# Altium schematic sheet SD²原理图.SchDoc: ESP8266小电视
size A4; DrawnBy: Misaka; Address1: L3, 12a Rodborough Rd; Address2: Frenchs Forest; Address3: NSW; Address4: Australia 2086; Revision: Rev 1.0; SheetNumber: 1; SheetTotal: 1; PageSetup: Record=PageOptions|CenterHorizontal=True|CenterVertical=True|PrintScale=1.00|XCorrection=1.00|YCorrection=1.00|PrintKind=0|BorderSize=5000000|LeftOffset=0|BottomOffset=0|Orientation=2|PaperLength=1000|PaperWidth=1000|Scale=100|PaperSource=7|PrintQuality=-3|MediaType=1|DitherType=10|PrintScaleMode=1|PaperKind=A4|PaperIndex=9
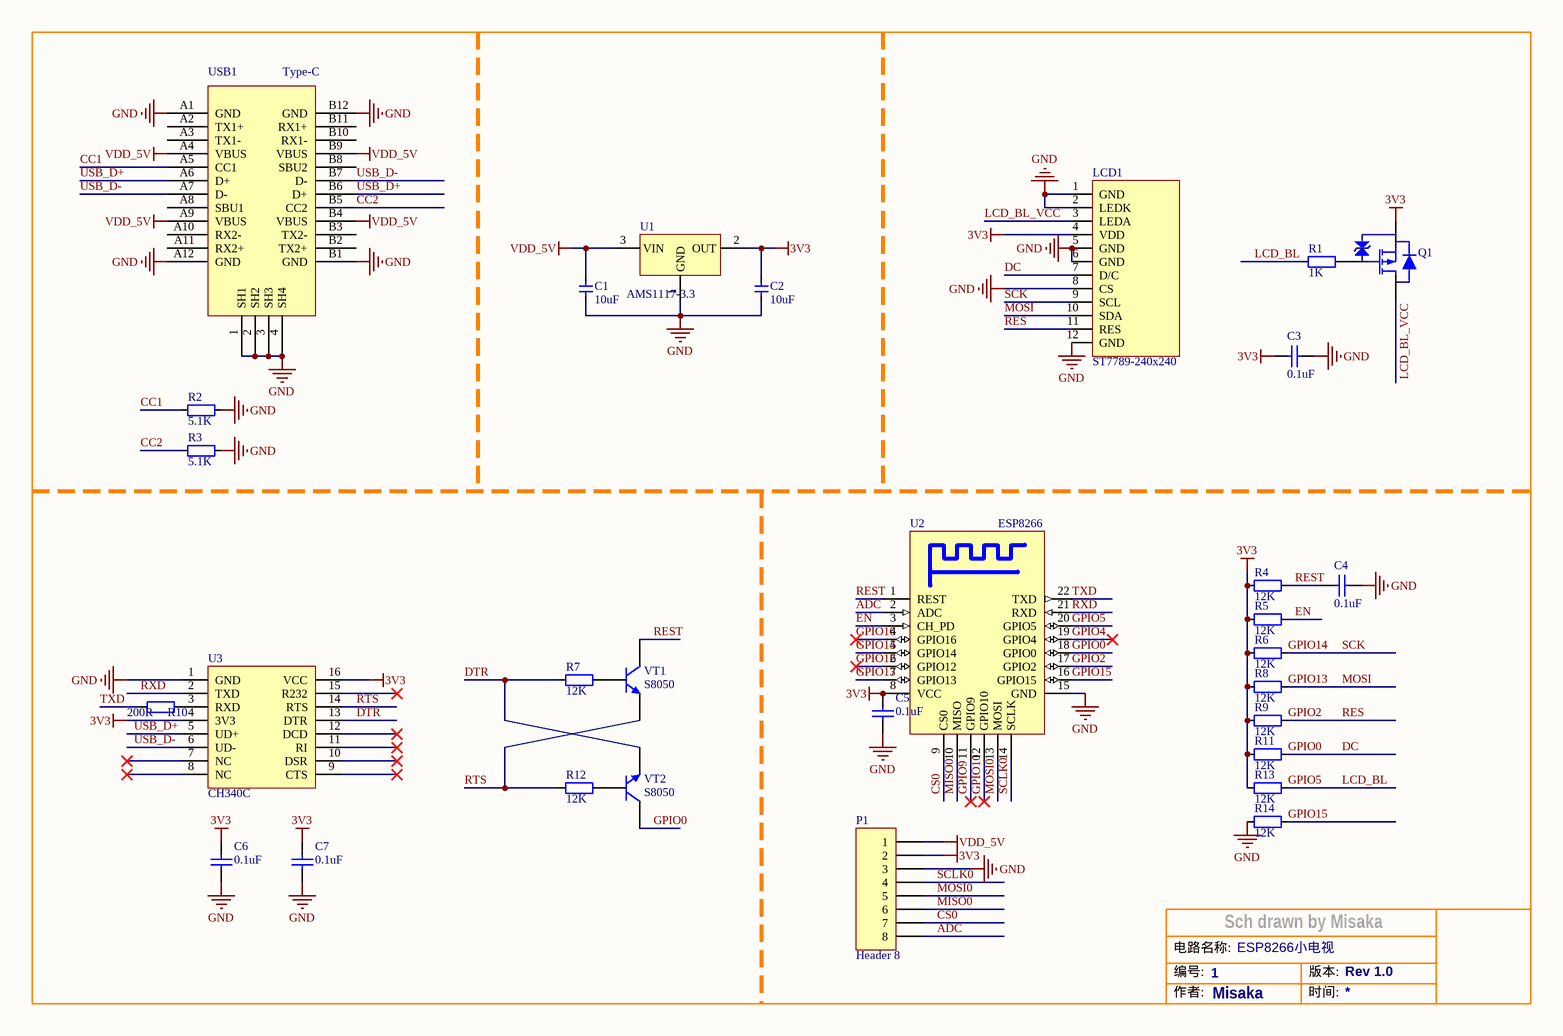
[diagram p0: SD²原理图.SchDoc]

## Parts
C1  10uF  [C_0603]
C2  10uF  [C_0603]
C3  0.1uF  [C_0603]
C4  0.1uF  [C_0603]
C5  0.1uF  [C_0603]
C6  0.1uF  [C_0603]
C7  0.1uF  [C_0603]
LCD1  ST7789-240x240  [LCD-240X240-12P]
P1  Header 8  [FFC_0.5_8]
Q1  AO3415A  [SOT-23-y]  (value not drawn)
R1  1K  [R_0603]
R2  5.1K  [R_0603]
R3  5.1K  [R_0603]
R4  12K  [R_0603]
R5  12K  [R_0603]
R6  12K  [R_0603]
R7  12K  [R_0603]
R8  12K  [R_0603]
R9  12K  [R_0603]
R10  200R  [R_0603]
R11  12K  [R_0603]
R12  12K  [R_0603]
R13  12K  [R_0603]
R14  12K  [R_0603]
U1  AMS1117-3.3  [SOT223_y]
U2  ESP8266  [8266]
U3  CH340C  [SOP16N_N]
USB1  Type-C  [Type-C-TOP]
VT1  S8050  [SOT-23-y]
VT2  S8050  [SOT-23-y]

## Nets
3V3: C2.2 C3.2 C5.2 C6.2 C7.2 LCD1.4(VDD) P1.2 Q1.2(S) R4.1 R5.1 R6.1 R8.1 R9.1 R11.1 R13.1 U1.2(OUT) U2.8(VCC) U3.4(3V3) U3.16(VCC)
GND: C1.1 C2.1 C3.1 C4.1 C5.1 C6.1 C7.1 LCD1.1(GND) LCD1.2(LEDK) LCD1.5(GND) LCD1.6(GND) LCD1.8(CS) LCD1.12(GND) P1.3 R2.2 R3.2 R14.1 U1.1(GND) U2.15(GND) U3.1(GND) USB1.1(SH1) USB1.2(SH2) USB1.3(SH3) USB1.4(SH4) USB1.A1(GND) USB1.A12(GND) USB1.B1(GND) USB1.B12(GND)
VDD_5V: C1.2 P1.1 U1.3(VIN) USB1.A4(VBUS) USB1.A9(VBUS) USB1.B4(VBUS) USB1.B9(VBUS)
ADC: P1.8 U2.2(ADC)
CC1: R2.1 USB1.A5(CC1)
CC2: R3.1 USB1.B5(CC2)
CS0: P1.7 U2.9(CS0)
DC: LCD1.7(D/C) R11.2 U2.18(GPIO0) VT2.3(C)  [also labelled GPIO0]
DTR: R7.1 U3.13(DTR) VT2.2(E)
EN: R5.2 U2.3(CH_PD)
GPIO2: LCD1.11(RES) R9.2 U2.17(GPIO2)  [also labelled RES]
GPIO4: U2.19(GPIO4)
GPIO5: R1.1 R13.2 U2.20(GPIO5)  [also labelled LCD_BL]
GPIO9: U2.11(GPIO9)
GPIO10: U2.12(GPIO10)
GPIO12: U2.6(GPIO12)
GPIO13: LCD1.10(SDA) R8.2 U2.7(GPIO13)  [also labelled MOSI]
GPIO14: LCD1.9(SCL) R6.2 U2.5(GPIO14)  [also labelled SCK]
GPIO15: R14.2 U2.16(GPIO15)
GPIO16: U2.4(GPIO16)
LCD_BL_VCC: LCD1.3(LEDA) Q1.3(D)
MISO0: P1.6 U2.10(MISO)
MOSI0: P1.5 U2.13(MOSI)
REST: C4.2 R4.2 U2.1(REST) VT1.3(C)
RTS: R12.1 U3.14(RTS) VT1.2(E)
RXD: U2.21(RXD) U3.2(TXD)
SCLK0: P1.4 U2.14(SCLK)
TXD: R10.2 U2.22(TXD)
USB_D+: U3.5(UD+) USB1.A6(D+) USB1.B6(D+)
USB_D-: U3.6(UD-) USB1.A7(D-) USB1.B7(D-)
NetQ1_1: Q1.1(G) R1.2
NetR7_2: R7.2 VT1.1(B)
NetR10_1: R10.1 U3.3(RXD)
NetR12_2: R12.2 VT2.1(B)

Not connected (* = marked no-connect by the designer): U3 7(NC)* 8(NC)* 9(CTS)* 10(DSR)* 11(RI)* 12(DCD)* 15(R232)*; USB1 A2(TX1+) A3(TX1-) A8(SBU1) A10(RX2-) A11(RX2+) B2(TX2+) B3(TX2-) B8(SBU2) B10(RX1-) B11(RX1+)

## Notes on the sheet
- 电路名称:
- 编号:
- Sch drawn by Misaka
- 版本:
- 作者:
- 时间:

## Library data of the parts
C1 C2 = 电容-0402: Capacitor; Value: 0.1u
C3-C7 = Cap: Capacitor; Value: 100pF; Published: 8-Jun-2000; LatestRevisionDate: 17-Jul-2002; LatestRevisionNote: Re-released for DXP Platform.; PackageReference: RAD-0.3; Publisher: Altium Limited; PackageDescription: Radial Cap, Thru-Hole; 2 Leads; 0.3 in Pin Spacing
LCD1 = LCD-240x240: 显示屏
P1 = Header 8: Header, 8-Pin; LatestRevisionDate: 17-Jul-2002; LatestRevisionNote: Re-released for DXP Platform.; Publisher: Altium Limited
Q1 = AO3415A: MOSFET; Published: 8-Jun-2000; LatestRevisionDate: 17-Jul-2002; LatestRevisionNote: Re-released for DXP Platform.; PackageVersion: 1995/1996; PackageReference: E3; Publisher: Altium Limited; PackageDescription: TO, Flat Index; 3 In-Line, Axial Leads; Body Dia. 4.6mm; Lead Dia. 0.5 mm (max)
R1-R14 = 电阻-0402: Resistor; Value: 22R
U1 = LM317M
USB1 = USB-Type-C-TOP
VT1 VT2 = SMT_TRIODE_NPN: Surface mount NPN transistor, package SOT-23